# Altium schematic sheet SIDE-BRUSH-MOTORs .SchDoc
size A4; SheetNumber: 25; SheetTotal: 32
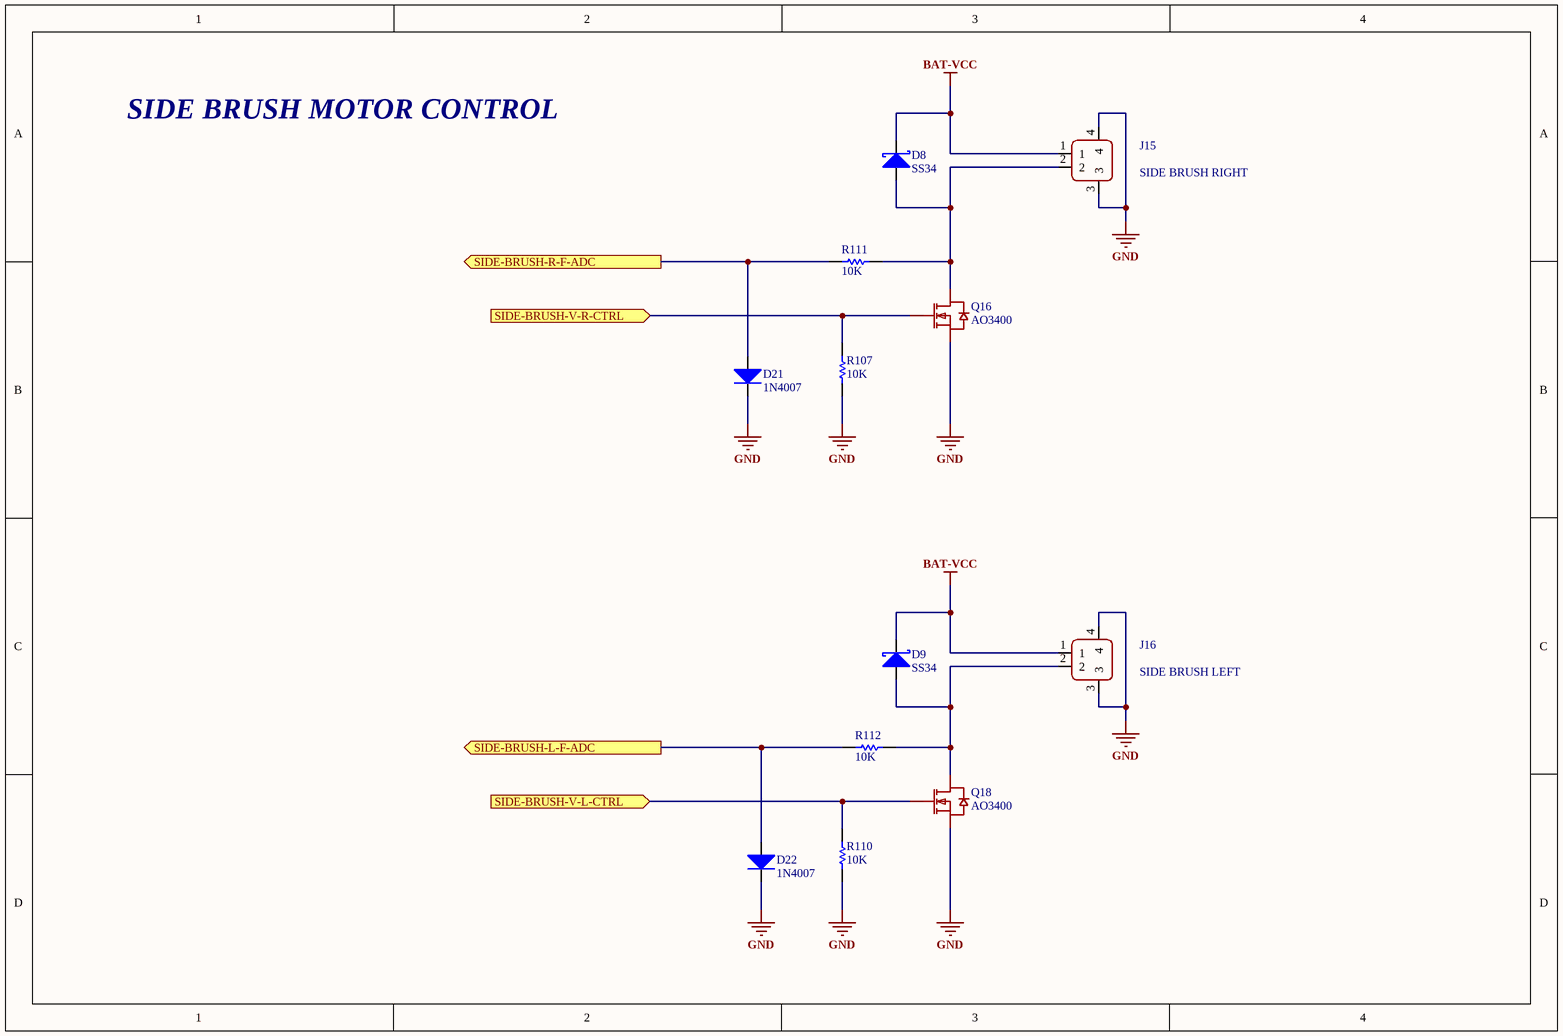
[diagram p0: SIDE-BRUSH-MOTORs .SchDoc]

## Parts
D8  SS34  [SMA]
D9  SS34  [SMA]
D21  1N4007  [SOD123]
D22  1N4007  [SOD123]
J15  SIDE BRUSH RIGHT  [CONN-SMD_2P-P1.50_ZX-ZH1.5-2PWT]
J16  SIDE BRUSH LEFT  [CONN-SMD_2P-P1.50_ZX-ZH1.5-2PWT]
Q16  AO3400  [SOT23-3D]
Q18  AO3400  [SOT23-3D]
R107  10K  [RES-0402]
R110  10K  [RES-0402]
R111  10K  [RES-0402]
R112  10K  [RES-0402]

## Ports
SIDE-BRUSH-L-F-ADC (out, see Controller-RK3562-TOP[2C]), SIDE-BRUSH-R-F-ADC (out, see Controller-RK3562-TOP[2C]), SIDE-BRUSH-V-L-CTRL (in, see Controller-RK3562-TOP[2C]), SIDE-BRUSH-V-R-CTRL (in, see Controller-RK3562-TOP[2C])

## Nets
BAT-VCC: D8.2(K) D9.2(K) J15.1 J16.1
GND: D21.2(K) D22.2(K) J15.3 J15.4 J16.3 J16.4 Q16.2(S) Q18.2(S) R107.1 R110.1
SIDE-BRUSH-L-F-ADC: D22.1(A) R112.2 ; port SIDE-BRUSH-L-F-ADC
SIDE-BRUSH-R-F-ADC: D21.1(A) R111.2 ; port SIDE-BRUSH-R-F-ADC
SIDE-BRUSH-V-L-CTRL: Q18.1(G) R110.2 ; port SIDE-BRUSH-V-L-CTRL
SIDE-BRUSH-V-R-CTRL: Q16.1(G) R107.2 ; port SIDE-BRUSH-V-R-CTRL
NetD8_1: D8.1(A) J15.2 Q16.3(D) R111.1
NetD9_1: D9.1(A) J16.2 Q18.3(D) R112.1

## Notes on the sheet
- SIDE BRUSH MOTOR CONTROL

## Library data of the parts
D8 D9 = DIODE-2: ManufacturingPartNumber: *; Manufacturer: *; SupplierPartNumber: *; Supplier: *; VoltageRate: *
D21 D22 = DIODE-1: ManufacturingPartNumber: *; Manufacturer: *; SupplierPartNumber: *; Supplier: *; VoltageRate: *
J15 J16 = HDRx2: ManufacturingPartNumber: *; Manufacturer: *; SupplierPartNumber: *; Supplier: *; VoltageRate: *
Q16 Q18 = N-MOS-SOT23: ManufacturingPartNumber: *; Manufacturer: *; SupplierPartNumber: *; Supplier: *; VoltageRate: *
R107 R110-R112 = Resistor-1: ManufacturingPartNumber: *; Manufacturer: *; SupplierPartNumber: *; Supplier: *; VoltageRate: *